# Altium schematic sheet Switching_Circuits.SchDoc
size A3; SheetNumber: 5; SheetTotal: 7
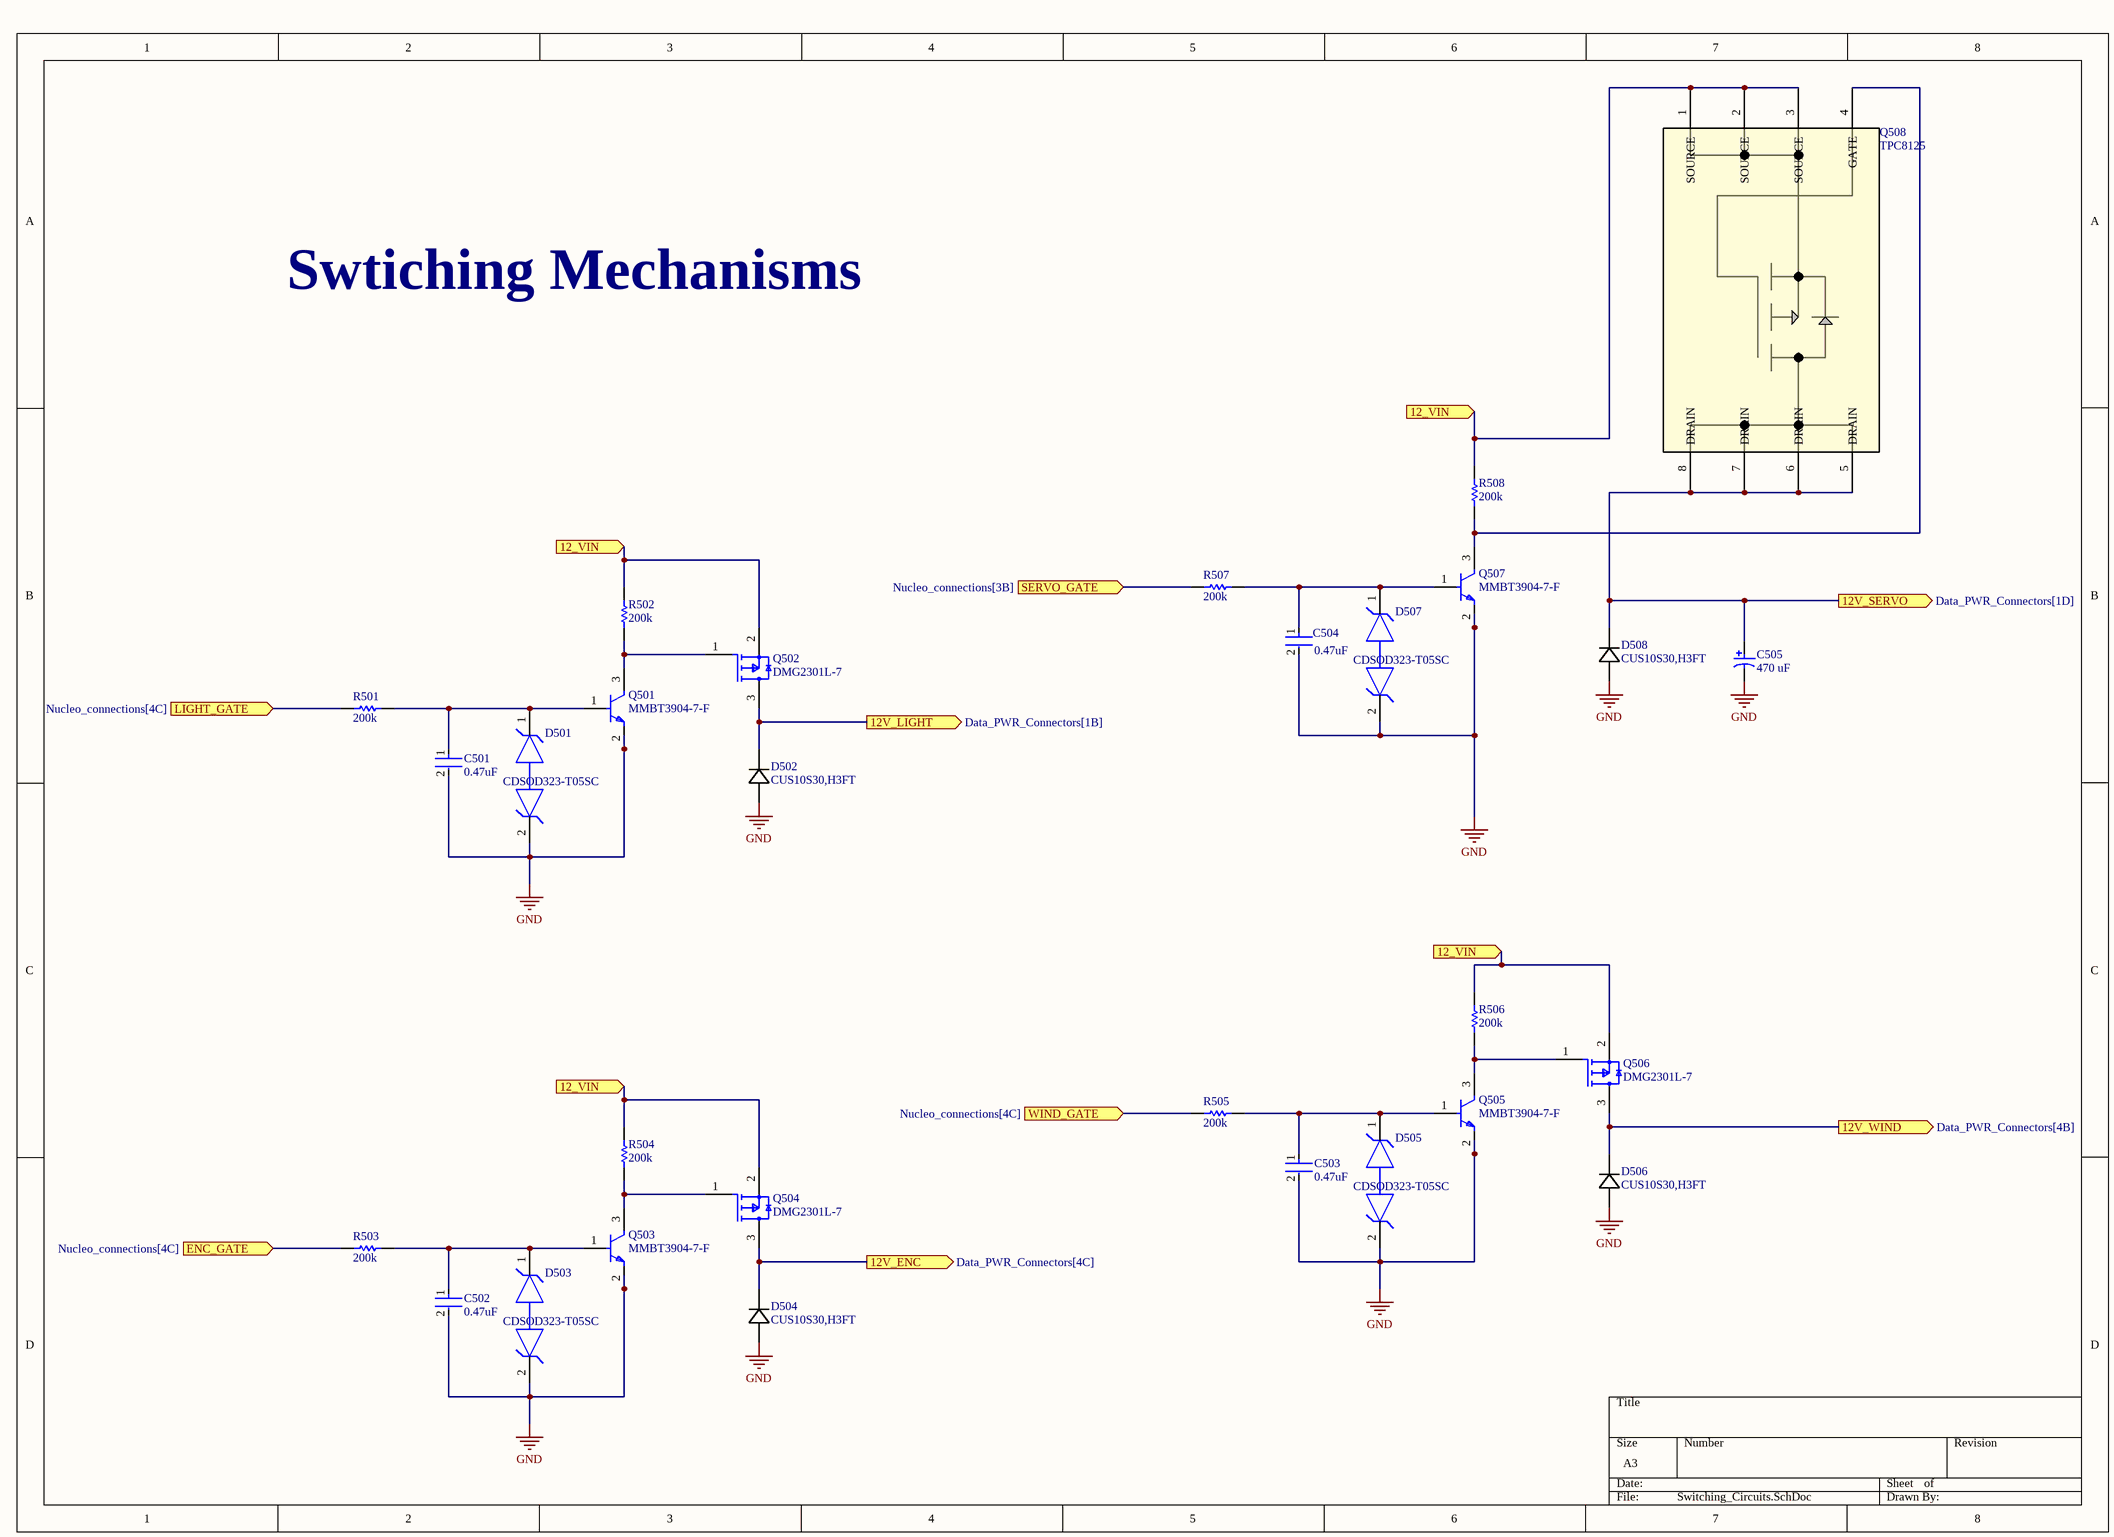
[diagram p0: Switching_Circuits.SchDoc]

## Parts
C501  0.47uF  [FP-GRM21B-0_15-IPC_B]
C502  0.47uF  [FP-GRM21B-0_15-IPC_B]
C503  0.47uF  [FP-GRM21B-0_15-IPC_B]
C504  0.47uF  [FP-GRM21B-0_15-IPC_B]
C505  470 uF  [PNSC-CAP-10x20-P2]
D501  CDSOD323-T05SC  [FP-SOD-323-CA-MFG]
D502  CUS10S30,H3FT  [USC_TOS]
D503  CDSOD323-T05SC  [FP-SOD-323-CA-MFG]
D504  CUS10S30,H3FT  [USC_TOS]
D505  CDSOD323-T05SC  [FP-SOD-323-CA-MFG]
D506  CUS10S30,H3FT  [USC_TOS]
D507  CDSOD323-T05SC  [FP-SOD-323-CA-MFG]
D508  CUS10S30,H3FT  [USC_TOS]
Q501  MMBT3904-7-F  [FP-SOT23-IPC_A]
Q502  DMG2301L-7  [FP-SOT23-MFG]
Q503  MMBT3904-7-F  [FP-SOT23-IPC_A]
Q504  DMG2301L-7  [FP-SOT23-MFG]
Q505  MMBT3904-7-F  [FP-SOT23-IPC_A]
Q506  DMG2301L-7  [FP-SOT23-MFG]
Q507  MMBT3904-7-F  [FP-SOT23-IPC_A]
Q508  TPC8125  [SOP-8_TOS]
R501  200k  [RESC2013X70X40LL20T20]
R502  200k  [RESC2013X70X40LL20T20]
R503  200k  [RESC2013X70X40LL20T20]
R504  200k  [RESC2013X70X40LL20T20]
R505  200k  [RESC2013X70X40LL20T20]
R506  200k  [RESC2013X70X40LL20T20]
R507  200k  [RESC2013X70X40LL20T20]
R508  200k  [RESC2013X70X40LL20T20]

## Ports
12_VIN (in, see Data_PWR_Connectors[1C], Data_PWR_Connectors[3B], Power_Management[1A], Power_Management[1C], Power_Management[3B], Protection_Circuit[4B], Switching_Circuits[3B], Switching_Circuits[3C], Switching_Circuits[6B]), 12_VIN (in, see Data_PWR_Connectors[1C], Data_PWR_Connectors[3B], Power_Management[1A], Power_Management[1C], Power_Management[3B], Protection_Circuit[4B], Switching_Circuits[3B], Switching_Circuits[3C], Switching_Circuits[6C]), 12_VIN (in, see Data_PWR_Connectors[1C], Data_PWR_Connectors[3B], Power_Management[1A], Power_Management[1C], Power_Management[3B], Protection_Circuit[4B], Switching_Circuits[3B], Switching_Circuits[6B], Switching_Circuits[6C]), 12_VIN (in, see Data_PWR_Connectors[1C], Data_PWR_Connectors[3B], Power_Management[1A], Power_Management[1C], Power_Management[3B], Protection_Circuit[4B], Switching_Circuits[3C], Switching_Circuits[6B], Switching_Circuits[6C]), 12V_ENC (out, see Data_PWR_Connectors[4C]), 12V_LIGHT (out, see Data_PWR_Connectors[1B]), 12V_SERVO (out, see Data_PWR_Connectors[1D]), 12V_WIND (out, see Data_PWR_Connectors[4B]), ENC_GATE (in, see Nucleo_connections[4C]), LIGHT_GATE (in, see Nucleo_connections[4C]), SERVO_GATE (in, see Nucleo_connections[3B]), WIND_GATE (in, see Nucleo_connections[4C])

## Nets
GND: C501.2 C502.2 C503.2 C504.2 C505.2 D501.2 D502.2(anode) D503.2 D504.2(anode) D505.2 D506.2(anode) D507.2 D508.2(anode) Q501.2(E) Q503.2(E) Q505.2(E) Q507.2(E)
12_VIN: Q502.2(S) Q504.2(S) Q506.2(S) Q508.1(SOURCE) Q508.2(SOURCE) Q508.3(SOURCE) R502.2 R504.2 R506.2 R508.2 ; port 12_VIN
12V_ENC: D504.1(cathode) Q504.3(D) ; port 12V_ENC
12V_LIGHT: D502.1(cathode) Q502.3(D) ; port 12V_LIGHT
12V_SERVO: C505.1 D508.1(cathode) Q508.5(DRAIN) Q508.6(DRAIN) Q508.7(DRAIN) Q508.8(DRAIN) ; port 12V_SERVO
12V_WIND: D506.1(cathode) Q506.3(D) ; port 12V_WIND
ENC_GATE: R503.1 ; port ENC_GATE
LIGHT_GATE: R501.1 ; port LIGHT_GATE
SERVO_GATE: R507.1 ; port SERVO_GATE
WIND_GATE: R505.1 ; port WIND_GATE
NetC501_1: C501.1 D501.1 Q501.1(B) R501.2
NetC502_1: C502.1 D503.1 Q503.1(B) R503.2
NetC503_1: C503.1 D505.1 Q505.1(B) R505.2
NetC504_1: C504.1 D507.1 Q507.1(B) R507.2
NetQ501_3: Q501.3(C) Q502.1(G) R502.1
NetQ503_3: Q503.3(C) Q504.1(G) R504.1
NetQ505_3: Q505.3(C) Q506.1(G) R506.1
NetQ507_3: Q507.3(C) Q508.4(GATE) R508.1

## Notes on the sheet
- Swtiching Mechanisms

## Library data of the parts
C501-C504 = CMP-2007-03605-2: Chip Multilayer Ceramic Capacitors for General Purpose, 0805, 0.47uF, X7R, 15%, 10%, 100V; Capacitance: 470nF; Max Operating Temperature: 125°C; Dielectric: X7R; Length: 2mm; Case/Package: 0805; Case Code (Metric): 2012; Package Quantity: 1; Case Code (Imperial): 0805; REACH SVHC: No SVHC; Termination: SMD/SMT; Voltage Rating: 100V; Mount: Surface Mount; Depth: 1.25mm; Radiation Hardening: No; Width: 1.25mm; Material: Ceramic; Voltage: 100V; Voltage Rating (DC): 100V; Min Operating Temperature: -55°C; Thickness: 0.053inch; Packaging: Tape and Reel; Height: 1.25mm; Lead Free: Lead Free; Tolerance: 10%
C505 = CMP-2000-05308-1: Aluminum Electrolytic Capacitor, 470 uF, +/- 20%, 50 V, -55 to 105 degC, 2-Pin THD, RoHS, Bulk; Manufacturer: Panasonic; Package Version: Nov-12; Type: Radial; Lifetime@Temperature: 2000Hrs@105degC; Capacitance: 470µF; Rated Voltage: 50V; Ripple Current: 530mA; Case Size/Dimension: Ø10x20mm; Package Reference: CAP-10x20-P2; Package Description: 2-Pin Through Hole Device, Dia 10 mm, Body Length 20 mm, Pin Spacing 5 mm; Series: NHG; Datasheet Version: Nov-12; Datasheet URL: http://www.alliedelec.com/images/products/datasheets/bm/Panasonic/70067776.pdf; Package URL: http://www.alliedelec.com/images/products/datasheets/bm/Panasonic/70067776.pdf; Operating Temp-Max: 105degC; Operating Temp Range: -55to+105degC; Manufacturer URL: http://www.panasonic.com/
D501 D503 D505 D507 = CMP-07401-000040-1: TVS DIODE 5VWM 14.5VC SOD323; Direction: Bidirectional; Number of Bidirectional Channels: 1; Clamping Voltage: 13.5V; Diode Type: ZENER; Element Configuration: Single; Power Line Protection: No; Leakage Current: 10uA; Max Power Dissipation: 400W; Test Current: 1mA; Peak Pulse Current: 28A; Working Voltage: 5V; Min Breakdown Voltage: 6V; Capacitance: 350pF; Peak Pulse Power: 500W; Mount: Surface Mount; Contact Plating: Tin; Max Operating Temperature: 150°C; Min Operating Temperature: -55°C; Packaging: Tape and Reel; REACH SVHC: No SVHC; Length: 1.9mm; RoHS Compliant: Yes; Series: CDSOD323; Number of Channels: 1; Number of Elements: 1; Reverse Standoff Voltage: 5V; Termination: SMD/SMT; Number of Pins: 2; Max Breakdown Voltage: 6V; Package Quantity: 3000; Depth: 1.45mm; Polarity: Bidirectional; Radiation Hardening: No; Max Surge Current: 28A; Breakdown Voltage: 6V; Reverse Breakdown Voltage: 6V; Resistor Type: Zener; Operating Supply Voltage: 5V
D502 D504 D506 D508 = CUS10S30,H3FT: No Description Available; Mfr_Name: Toshiba Electronic Devices & Storage Corp.
Q501 Q503 Q505 Q507 = CMP-2000-04931-2: TRANS NPN 40V 0.2A SMD SOT23-3; Frequency: 300MHz; Power Dissipation: 350mW; Element Configuration: Single; Max Power Dissipation: 300mW; Max Collector Current: 200mA; Collector Emitter Saturation Voltage: 300mV; Number of Elements: 1; hFE Min: 100; Collector Base Voltage (VCBO): 60V; Emitter Base Voltage (VEBO): 6V; Contact Plating: Tin; Package Quantity: 3000; Max Frequency: 300MHz; REACH SVHC: No SVHC; Max Operating Temperature: 150°C; Width: 1.4mm; Collector Emitter Voltage (VCEO): 40V; Voltage Rating (DC): 40V; Radiation Hardening: No; Case/Package: SOT-23; Height: 1mm; Collector Emitter Breakdown Voltage: 40V; Length: 3.05mm; Polarity: NPN; Packaging: Tape and Reel; Number of Pins: 3; Min Operating Temperature: -55°C; Gain Bandwidth Product: 300MHz; Mount: Surface Mount; Weight: 0.000282oz; Continuous Collector Current: 200mA; Transition Frequency: 300MHz; Max Breakdown Voltage: 40V; Lead Free: Lead Free
Q502 Q504 Q506 = CMP-12801-000065-1: MOSFET P-CH 20V 3A SOT23; Manufacturer: Diodes Inc.; Number Of Channels: 1; Turn On Delay Time: 5ns; Drain To Source Resistance: 120mΩ; Max Junction Temp: +150°C; Gate To Source Voltage: 8V; Power Dissipation: 1.5W; Rthja Max: 83°C/W; Max Forward Diode Voltage: -1.2V; Standoff Height: 0.013mm; Threshold Vgs Min: -0.4V; Input Capacitace At Vds: 476pF @ -10V; Depletion Mode: False; Gate Charge At Vgs: 5.5nC @ -4.5V; Pulse Drain Current: -10A; Drain To Source Voltage: -20V; Continuous Drain Current: -3A; Turn Off Delay Time: 30ns; Lead Free: Yes; Package: SOT23; ComponentLink2Description: Datasheet; Device Class L3: MOSFETs; Device Class L1: Discrete Semiconductors; Manufacturer Part Number: DMG2301L-7; Automotive: No; Height: 1.1mm; Category: Trans; Temperature Range High: +150°C; Digikey Description: MOSFET P-CH 20V 3A SOT23; RoHS: TRUE; Number Of P Channels: 1; Footprint Url: https://www.diodes.com/assets/Package-Files/SOT23.pdf; Octopart: https://octopart.com/dmg2301l-7-diodes+inc.-67250456; ComponentLink2URL: https://www.diodes.com/assets/Datasheets/DMG2301L.pdf; Mouser Description: Single P-Channel 20 V 1.5 W 5.5 nC Silicon Surface Mount Mosfet - SOT-23; Drain To Source Breakdown Voltage: -20V; Threshold Vgs Max: -1.2V; Device Class L2: Transistors; Temperature: -55°C to +150°C; Temperature Range Low: -55°C
Q508 = TPC8125: No Description Available; Mfr_Name: Toshiba Electronic Devices & Storage Corp.; Digi-Key_Part_Number_1: TPC8125LQ(S-ND; RefDes: RefDes; Type: Type
R501-R508 = CMP-2001-00028-1: Manufacturer: Panasonic; Part Number: ERJ-6ENF2003V